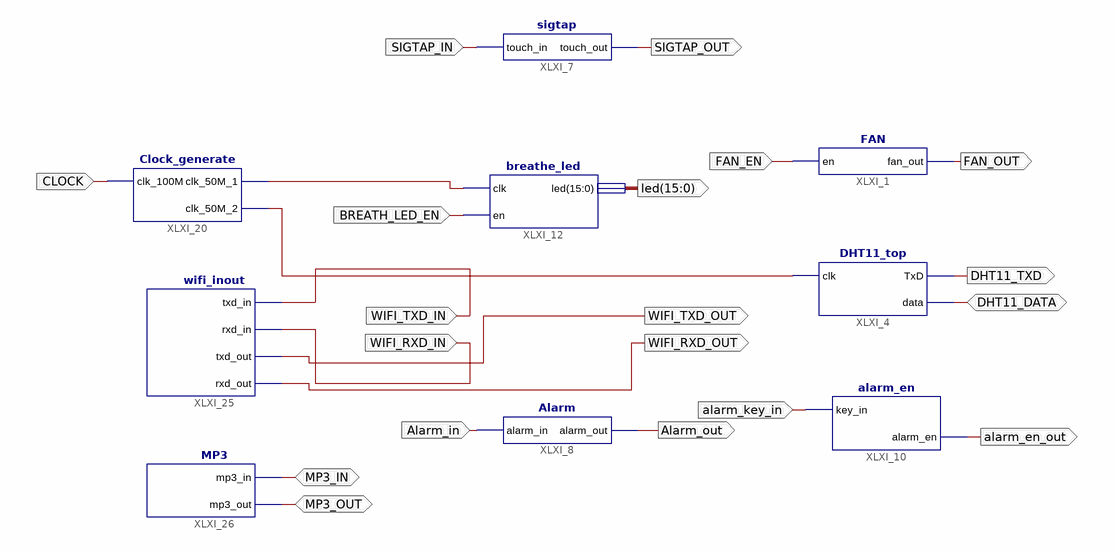
[diagram p0: schematic sheet 1]
// Xilinx ISE schematic TOP.sch (artix7) as structural Verilog: 9 symbols, 19 ports
module TOP (
  input  FAN_EN,
  input  BREATH_LED_EN,
  input  WIFI_TXD_IN,
  input  SIGTAP_IN,
  input  Alarm_in,
  input  alarm_key_in,
  input  CLOCK,
  input  WIFI_RXD_IN,
  inout  DHT11_DATA,
  inout  MP3_IN,
  inout  MP3_OUT,
  output FAN_OUT,
  output WIFI_RXD_OUT,
  output WIFI_TXD_OUT,
  output SIGTAP_OUT,
  output DHT11_TXD,
  output Alarm_out,
  output alarm_en_out,
  output [15:0] led
);

  wire BREATH_LED_CLK, DHT11_CLK;

  sigtap XLXI_7 (.touch_in(SIGTAP_IN), .touch_out(SIGTAP_OUT));
  DHT11_top XLXI_4 (.clk(DHT11_CLK), .TxD(DHT11_TXD), .data(DHT11_DATA));
  FAN XLXI_1 (.en(FAN_EN), .fan_out(FAN_OUT));
  Alarm XLXI_8 (.alarm_in(Alarm_in), .alarm_out(Alarm_out));
  alarm_en XLXI_10 (.key_in(alarm_key_in), .alarm_en(alarm_en_out));
  breathe_led XLXI_12 (.clk(BREATH_LED_CLK), .en(BREATH_LED_EN), .led(led));
  Clock_generate XLXI_20 (.clk_100M(CLOCK), .clk_50M_1(BREATH_LED_CLK), .clk_50M_2(DHT11_CLK));
  wifi_inout XLXI_25 (.txd_in(WIFI_TXD_IN), .rxd_in(WIFI_RXD_IN), .txd_out(WIFI_TXD_OUT), .rxd_out(WIFI_RXD_OUT));
  MP3 XLXI_26 (.mp3_in(MP3_IN), .mp3_out(MP3_OUT));
endmodule
